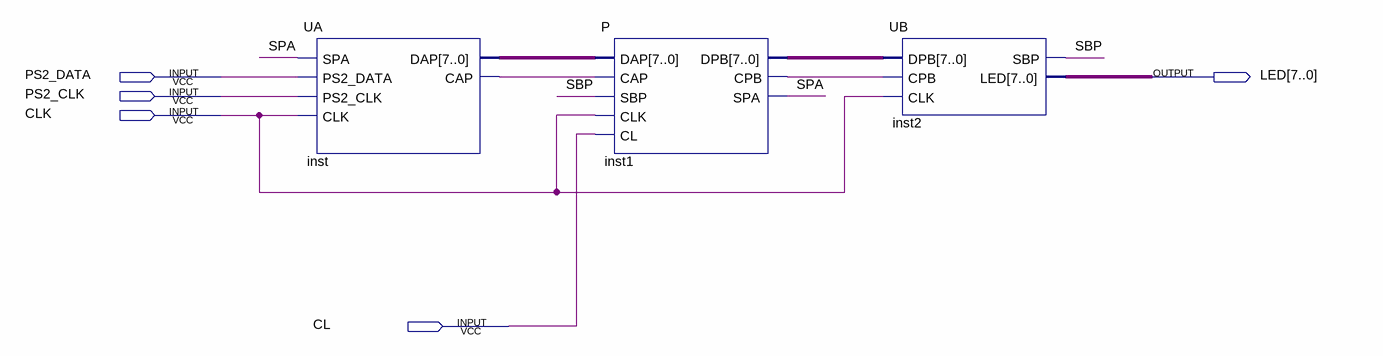
[diagram p0: schematic sheet]
// Quartus schematic Tastatura.bdf as structural Verilog: 3 symbols, 5 pins
module Tastatura (
  input  PS2_DATA,
  input  PS2_CLK,
  input  CLK,
  input  CL,
  output [7:0] LED
);

  wire inst1_cpb, inst_cap, SBP, SPA;
  wire [7:0] inst1_dpb, inst_dap;

  UA inst (.SPA(SPA), .PS2_DATA(PS2_DATA), .PS2_CLK(PS2_CLK), .CLK(CLK), .DAP(inst_dap), .CAP(inst_cap));
  P inst1 (.DAP(inst_dap), .CAP(inst_cap), .SBP(SBP), .CLK(CLK), .CL(CL), .DPB(inst1_dpb), .CPB(inst1_cpb), .SPA(SPA));
  UB inst2 (.DPB(inst1_dpb), .CPB(inst1_cpb), .CLK(CLK), .SBP(SBP), .LED(LED));
endmodule
